# EAGLE design MakeItHackinDEFCON29Badge_5_withSOIC (EAGLE 9.6.2)
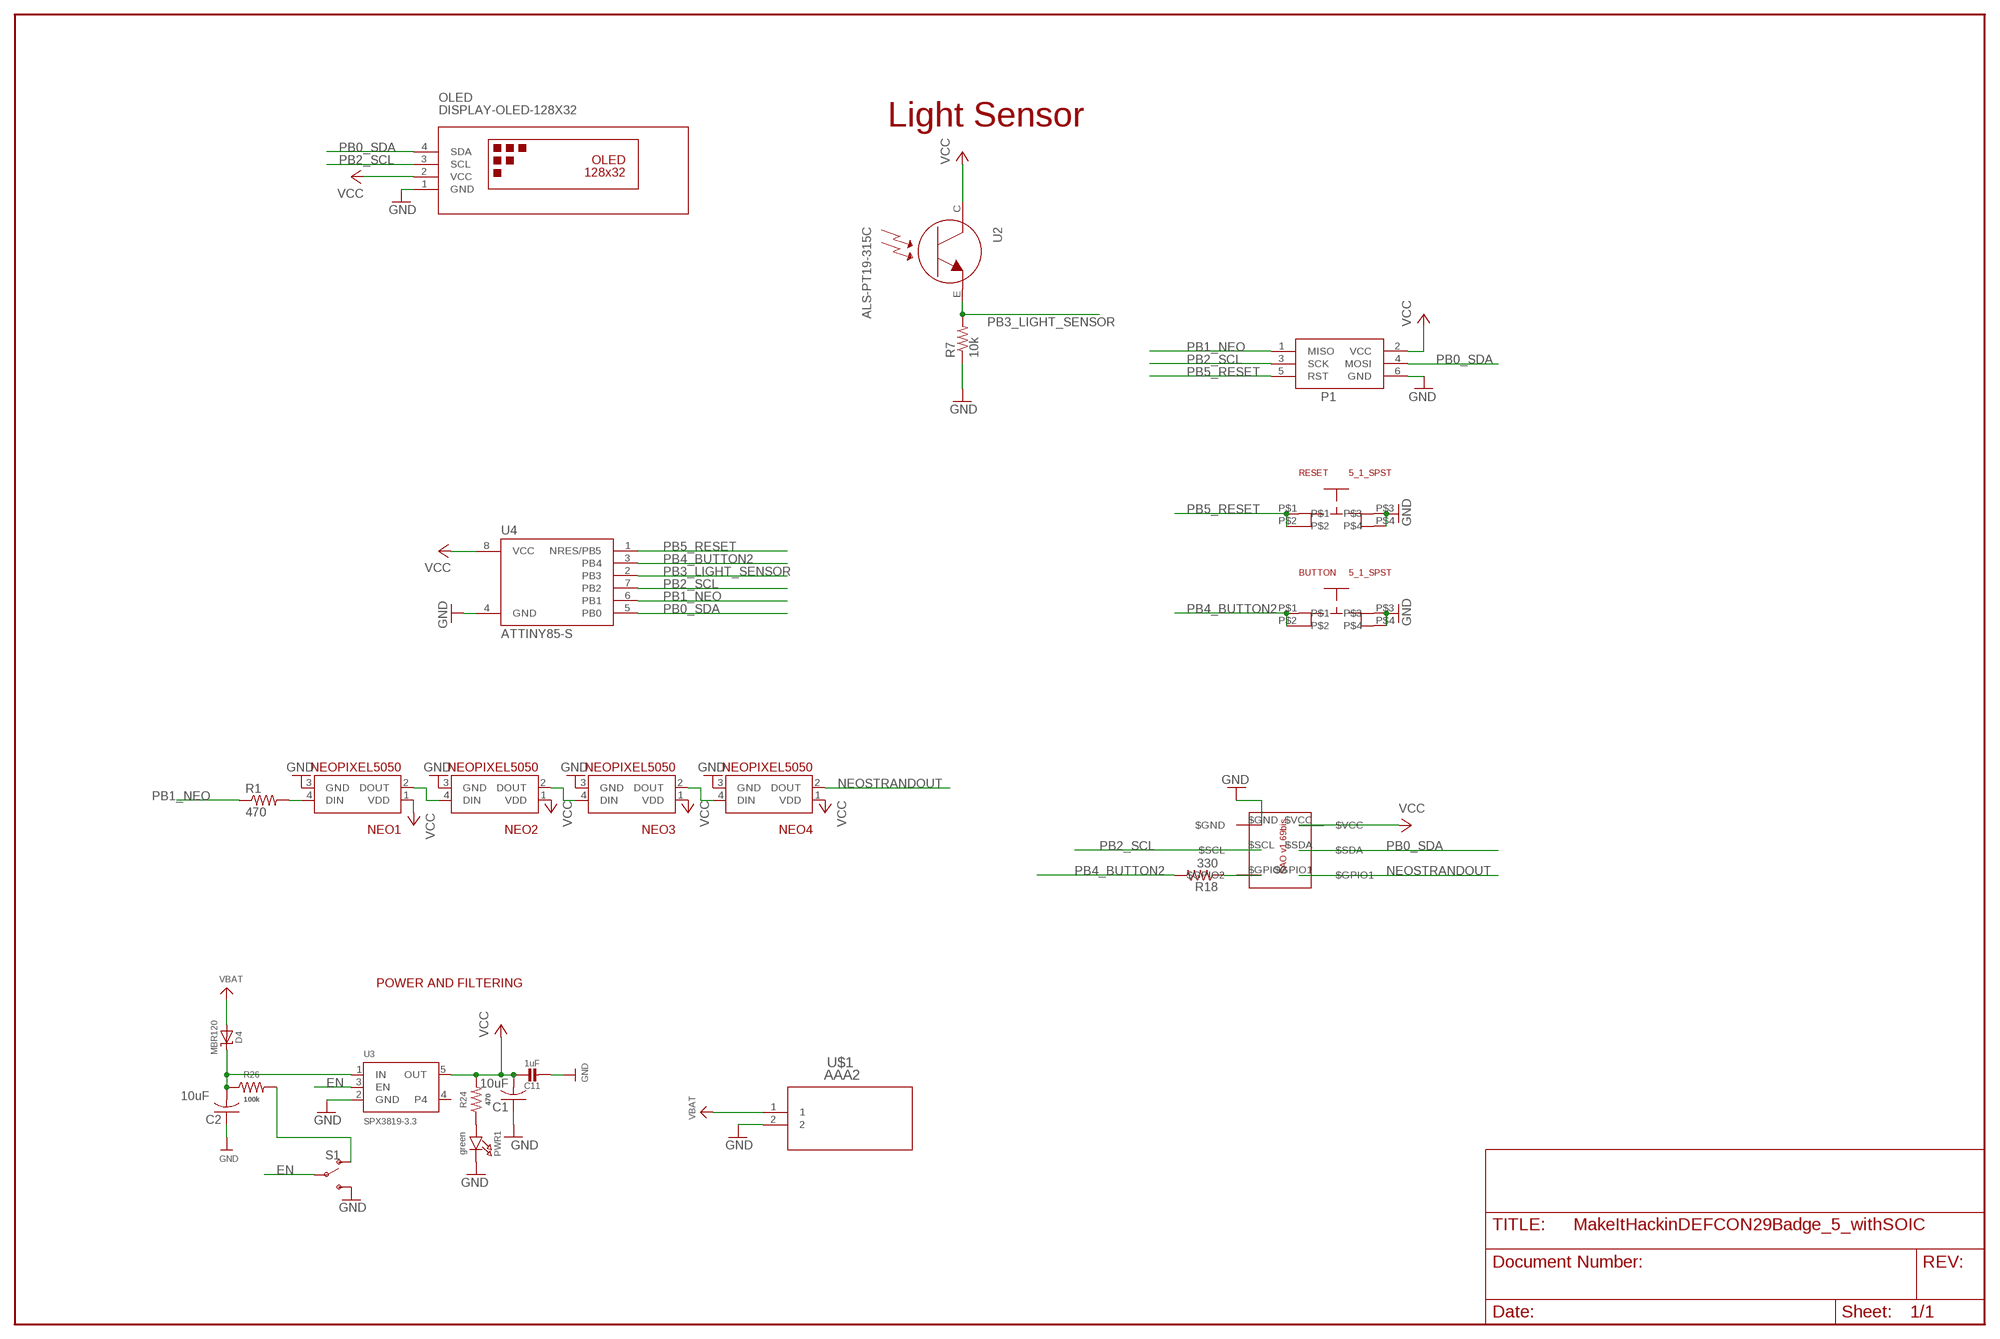
[diagram p0: schematic, sheet 1]

## Parts
BUTTON  5_1_SPST  [5_1_SPST]
C1  10uF  C-USC0805  [C0805]
C2  10uF  C-USC0805  [C0805]
C11  1uF  CAP_CERAMIC0805-NOOUTLINE  [0805-NO@1]
D4  MBR120  DIODE-SCHOTTKYSOD-123  [SOD-123]
NEO1  NEOPIXEL5050  [NEOPIXEL5050]
NEO2  NEOPIXEL5050  [NEOPIXEL5050]
NEO3  NEOPIXEL5050  [NEOPIXEL5050]
NEO4  NEOPIXEL5050  [NEOPIXEL5050]
OLED  DISPLAY-OLED-128X32  [DISPLAY-OLED-128X32]
P1  AVRISP-6  [AVRISP]
PWR1  green  LED0805_NOOUTLINE  [CHIPLED_0805_NOOUTLINE]
R1  470  R-US_R0805  [R0805]
R7  10k  R-US_R0805  [R0805]
R18  330  R-US_R0805  [R0805]
R24  470  R-US_R0805  [R0805]
R26  100k  R-US_R0805  [R0805]
RESET  5_1_SPST  [5_1_SPST]
S1  SWITCH-SPDT-SMD-AYZ0202  [SWITCH_DPDT_SMD_AYZ0202]
U2  ALS-PT19-315C  LIGHT_ALS-PT19-315C  [ALS-PT19-315C]
U3  SPX3819-3.3  VREG_SOT23-5  [SOT23-5]
U4  ATTINY85-S  [SOIC8_EIAJ_208MIL]
U$1  AAA2  [AAA2]
U$3  SAO-1.69  [2X3-SHROUDED-FEMALE]

## Nets
EN: S1.2(P) U3.3(EN)
GND [PWR]: BUTTON.P$3 BUTTON.P$4 C1.1 C2.1 C11.2 NEO1.3(GND) NEO2.3(GND) NEO3.3(GND) NEO4.3(GND) OLED.1(GND) P1.6(GND) PWR1.C R7.1 RESET.P$3 RESET.P$4 S1.3(S) U3.2(GND) U4.4(GND) U$1.2 U$3.$GND
N$1 [5V]: C2.2 D4.C R26.1 U3.1(IN)
N$7: R18.1 U$3.$GPIO2
N$9: PWR1.A R24.1
N$11: R26.2 S1.1(O)
N$12: NEO1.4(DIN) R1.2
N$18: NEO1.2(DOUT) NEO2.4(DIN)
N$20: NEO2.2(DOUT) NEO3.4(DIN)
N$21: NEO3.2(DOUT) NEO4.4(DIN)
NEOSTRANDOUT: NEO4.2(DOUT) U$3.$GPIO1
PB0_SDA: OLED.4(SDA) P1.4(MOSI) U4.5(PB0) U$3.$SDA
PB1_NEO: P1.1(MISO) R1.1 U4.6(PB1)
PB2_SCL: OLED.3(SCL) P1.3(SCK) U4.7(PB2) U$3.$SCL
PB3_LIGHT_SENSOR: R7.2 U2.E U4.2(PB3)
PB4_BUTTON2: BUTTON.P$1 BUTTON.P$2 R18.2 U4.3(PB4)
PB5_RESET: P1.5(RST) RESET.P$1 RESET.P$2 U4.1(NRES/PB5)
VBAT [PWR]: D4.A U$1.1
VCC [PWR]: C1.2 C11.1 NEO1.1(VDD) NEO2.1(VDD) NEO3.1(VDD) NEO4.1(VDD) OLED.2(VCC) P1.2(VCC) R24.2 U2.C U3.5(OUT) U4.8(VCC) U$3.$VCC
Unconnected: U3.4

## Notes on the sheet
- Light Sensor
- POWER AND FILTERING

## Library data of the parts
BUTTON RESET = TrophyParts:5_1_SPST
C1 C2 = rcl:C-US: CAPACITOR, American symbol; SPICEPREFIX: C
C11 = microbuilder:CAP_CERAMIC: Ceramic Capacitors For new designs, use the packages preceded by an '_' character since they are more reliable: The following footprints should be used on most boards: _0402 - Standard footprint for regular board layouts _0603 - Standard footprint for regular board layouts _0805 - Standard footprint for regular board layouts _1206 - Standard footprint for regular board layouts For extremely tight-pitch boards where space is at a premium, the following 'micro-pitch' footprints can be used (smaller pads, no silkscreen outline, etc.): _0402MP - Micro-pitch footprint for very dense/compact boards _0603MP - Micro-pitch footprint for very dense/compact boards _0805MP - Micro-pitch footprint for very dense/compact boards _1206MP - Micro-pitch footprint for very dense/compact boards
D4 = microbuilder:DIODE-SCHOTTKY
NEO1-NEO4 = TrophyParts:NEOPIXEL5050
OLED = Hatch2020:DISPLAY-OLED-128X32: 128x32 Dot Matrix OLED Module with I2C interface based on SSD1306 chip More details available here: http://www.tinyosshop.com/index.php?route=product/product&product_id=953 Schematic available here: http://www.tinyosshop.com/datasheet/OLED%2012832.pdf SSD1306 datasheet: https://cdn-shop.adafruit.com/datasheets/SSD1306.pdf Click here to find device on ebay.com <http://www.ebay.com/sch/oled+display+128x32+i2c>
P1 = adafruit:AVRISP: AVR ISP HEADER Standard 6 pin header for AVR programming
PWR1 = microbuilder:LED: LED 0603 - 0603 Surface Mount Package 2mA: Green LED - Low Power (3.9mcd, 2ma, 1.7Vf) - Digikey: 475-2709-2-ND Orange LED - Low Power (9.8mcd, 2ma, 1.8Vf) - Digikey: 475-1194-2-ND Red LED - Low Power (5mcd, 2ma, 1.8Vf) - Digikey: 475-1195-2-ND Yellow LED - Low Power (7mcd, 2ma, 1.8Vf) - Digikey: 475-1196-2-ND 5mA: Blue LED - Low Power (17mcd, 5ma, 2.9Vf) - Digikey: LNJ937W8CRACT-ND 0805 - 0805 Surface Mount Package 2mA: Red LED (8.8mcd, 2mA, 1.8Vf, Clear) - Low Power [Digikey: 475-2510-1-ND] Green LED (5mcd, 2mA, 1.8Vf, Clear) - Low Power [Digikey: 475-2730-1-ND] Yellow LED (11.3mcd, 2mA, 1.8Vf, Clear) - Low Power [Digikey: 475-2555-1-ND] 20mA: Red LED (104mcd, 20mA, Diffused) - LS R976 [Digikey: 475-1278-6-ND] Red LED (12mcd, 20mA, 2.0Vf, Clear) - APT2012EC [Digikey: 754-1128-1-ND] Green LED (15mcd, 20mA, 2.2Vf, Clear) - APT2012GC [Digikey: 754-1131-1-ND] Orange LED (160mcd, 20mA, 2.1Vf, Clear) - APT2012SECK [Digikey: 754-1130-1-ND] 1206 - 1206 Surface Mount Package Green LED (26mcd, 20mA, Diffused) - LG N971 [Digikey: 475-1407-6-ND] Red LED (15mcd, 20mA, Diffused) - LH N974 [Digikey: 475-1416-6-ND] Cree - Cree High-Power Surface Mount LEDs XPEBWT-L1-0000-00D50 - White 111lm 350mA 2.9Vf 6200K 110° XTEAWT-00-0000-00000LEE3 - White 114lm 350mA 2.85Vf 5000K 115° Everlight - Everlight 45-21 Series Surface Mount LEDs 45-21/QK2C-B2832AC2CB2/2T - Warm White 2000mcd 20mA 3.25Vf 3050K 120° 45-21/LK2C-B38452C4CB2/2T - Nuetral White 2000mcd 20mA 3.25Vf 4150K 120° 45-21/LK2C-B50634C6CB2/2T - Cold White 2200mcd 20mA 3.25Vf 5650K 120° PLCC2 Reverse Mount LS T77K-J1L2-1-0-2-R18-Z - Red 11.25mcd 2mA 1.8Vf 630nm 120° LO T77K-L1M2-24-Z - Orange 19.6mcd 2mA 1.8Vf 606nm 120° LY T77K-K2M1-26-Z - Yellow 15.7mcd 2mA 1.8Vf 587nm 120°
R1 R7 R18 R24 R26 = rcl:R-US_: RESISTOR, American symbol; SPICEPREFIX: R
S1 = SparkFun-Switches:SWITCH-SPDT: Single Pole, Double Throw (SPDT) Switch Single-pole, double-throw (SPDT) switch. Variant Overview SMD-AYZ0202 Surface Mount DPDT Switch <https://www.sparkfun.com/products/597> (COM-00597) Used on e.g. LilyPad Arduino USB - ATmega32U4 Board <https://www.sparkfun.com/products/12049> PTH-11.6X4.0MM SPDT Mini Power Switch <https://www.sparkfun.com/products/102> (COM-00102) Used on e.g. SparkFun Simon Says - Through-Hole Soldering Kit <https://www.sparkfun.com/products/10547> (KIT-10547) PTH-11.6X4.0MM-KIT KIT version of SPDT Mini Power Switch - Simplifies soldering by removing tStop of switch pins - only one side can be soldered. PTH-11.6X4.0MM-LOCK LOCK version of SPDT Mini Power Switch - Offset pins hold switch in place for easier soldering. SMD-RIGHT-ANGLE Surface Mount Right Angle Switch <https://www.sparkfun.com/products/10860> (COM-10860) Used on e.g. SparkFun ESP8266 Thing <https://www.sparkfun.com/products/13231>; PROD_ID: SWCH-08179; SF_ID: COM-00597
U2 = microbuilder:LIGHT_ALS-PT19-315C: ALS-PT19-315C - Analog Light Sensor VCC: 2.5-5.5V
U3 = microbuilder:VREG_SOT23-5: SOT23-5 Fixed Voltage Regulators Part Current Out V Out V In V Dropout θJA (°C/W) TJ (°C) Digikey Part No. ADP121 150mA 3.3V 3.4-5.5V 0.09V @ 150mA -- -- ADP121-AUJZ33R7CT-ND ADP121 150mA 3.0V 3.1-5.5V 0.09V @ 150mA -- -- ADP121-AUJZ30R7CT-ND ADP122 300mA 3.3V 3.4-5.5V 0.085V @ 300mA -- -- ADP122AUJZ-3.3-R7CT-ND ADP1712 300mA 3.3V 3.5-5.5V 0.17V @ 300mA -- -- ADP1712AUJZ-3.3-R7TR-ND AP7311 (Low Cost) 150mA 3.3V 3.5-6V 0.15V @ 150mA -- -- AP7311-33WG-7DICT-ND LD39015M18R 150mA 1.8V 1.9V-5.5V 0.08V @ 100mA -- -- 497-6977-1-ND LP2985A-33DBVR 150mA 3.3V 3.3-16V 0.28V @ 150mA 206 150 296-18479-1-ND MCP1824T-3302E/OT 300mA 3.3V 3.5V-6V 0.2V @ 300mA -- -- MCP1824T-3302E/OTCT-ND MIC5205-2.5YM5 TR 150mA 2.5V 2.7-16V 0.165V @ 150mA -- -- 576-1257-2-ND MIC5205-3.0YM5 TR 150mA 3.0V 3.2V-16V 0.165V @ 150mA -- -- 576-1258-2-ND MIC5205-3.3YM5 TR 150mA 3.3V 3.5V-16V 0.165V @ 150mA -- -- 576-1259-2-ND TPS780330220 150mA 3.3V+2.2V 3.6-5.5V 250mV Max -- -- 296-23332-1-ND TDA3663/N1,135 100mA 3.3V 3.5-45V 0.18V @ 50mA -- -- 568-5343-1-ND Max operating temp can be calculated using θJA, TJ (max junction temperature), and power in watts. Set the "Maximum Ambient Temperature" until it reaches TJ ("Max Junction Temperature"), which is the absolute limit for safe use of the regulator: Heat Sink Temperature Calculator <http://www.daycounter.com/Calculators/Heat-Sink-Temperature-Calculator.phtml> For example, With 12V source into a 3.3V LP2985 and a 30mA load, we are dissipating (12V-3.3V) * 0.03A = 0.261W. With a θJA of 206 °C/W, a TJ of 150°C, and 261mW we can safely use the chip without a heat sink up to 75°C (=147.1°C Junction Temperature).
U4 = attiny25_45_85:ATTINY85*: ATMEL ATtiny 85 Packages: P = PDIP 08 30mil S = SOIC 08 EIAJ 208mil Technologies Note: for complete ordering code (temp. range, finish, tape&reel etc.) see www.atmel.com • Supply Voltage: V = (1.8…5.5)V | [blank] = (2.7…5.5)V • Speed: 10 = 10 MHz | 20 = 20 MHz Author: Dipl.-Ing. FH Rainer Bayer HHN Hochschule Heilbronn (Heilbronn University), rainer.bayer@hs-heilbronn.de Ingenieurbüro ing-rb, mail@ing-rb.de
U$1 = keystoneAAAmount:AAA2
U$3 = Hatch2020:SAO-1.69

## Net classes
0 default: width 0.152 mm
1 PWR: width 0.254 mm
2 5V: width 0.254 mm
3 GND: width 0.254 mm

## Board
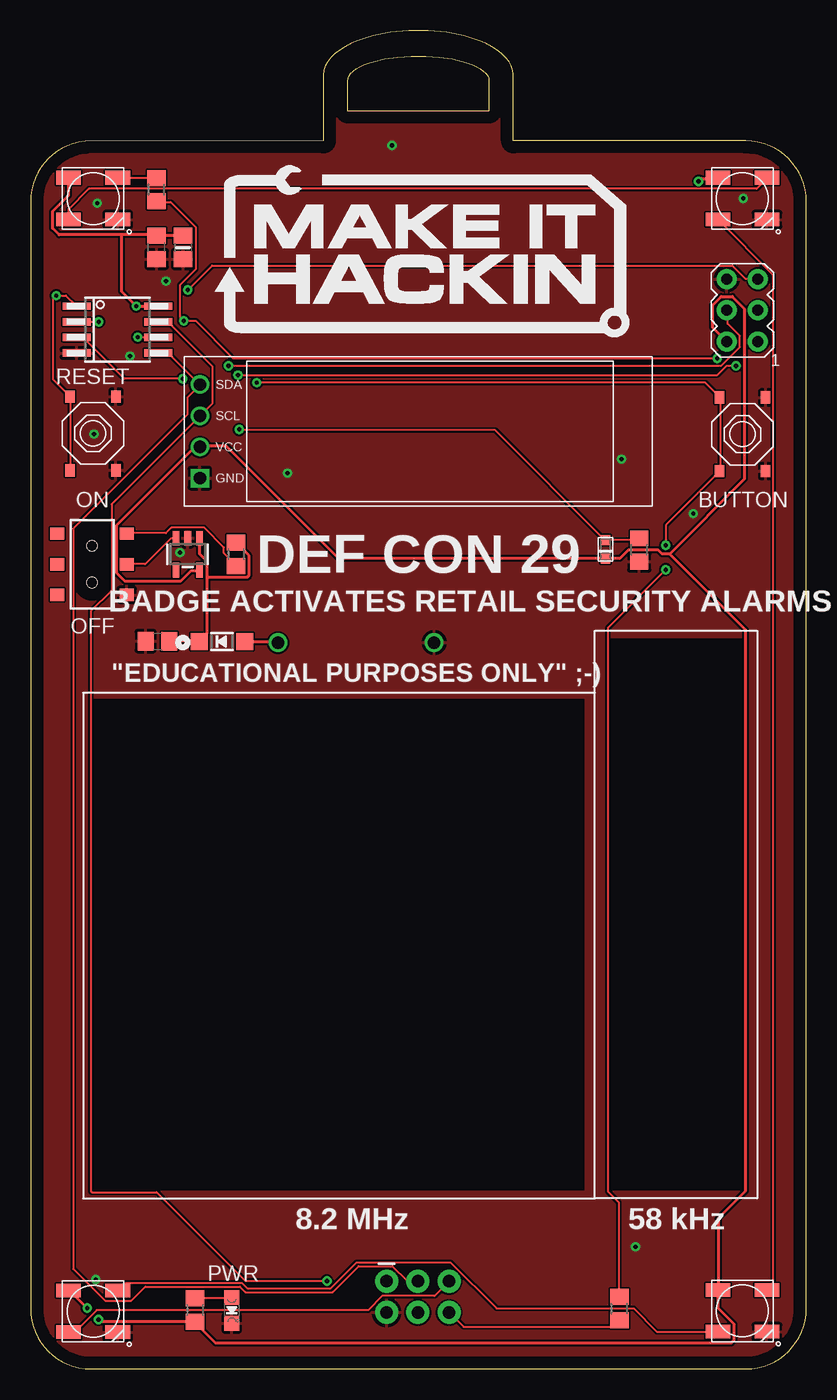
[diagram p1: board, top side]
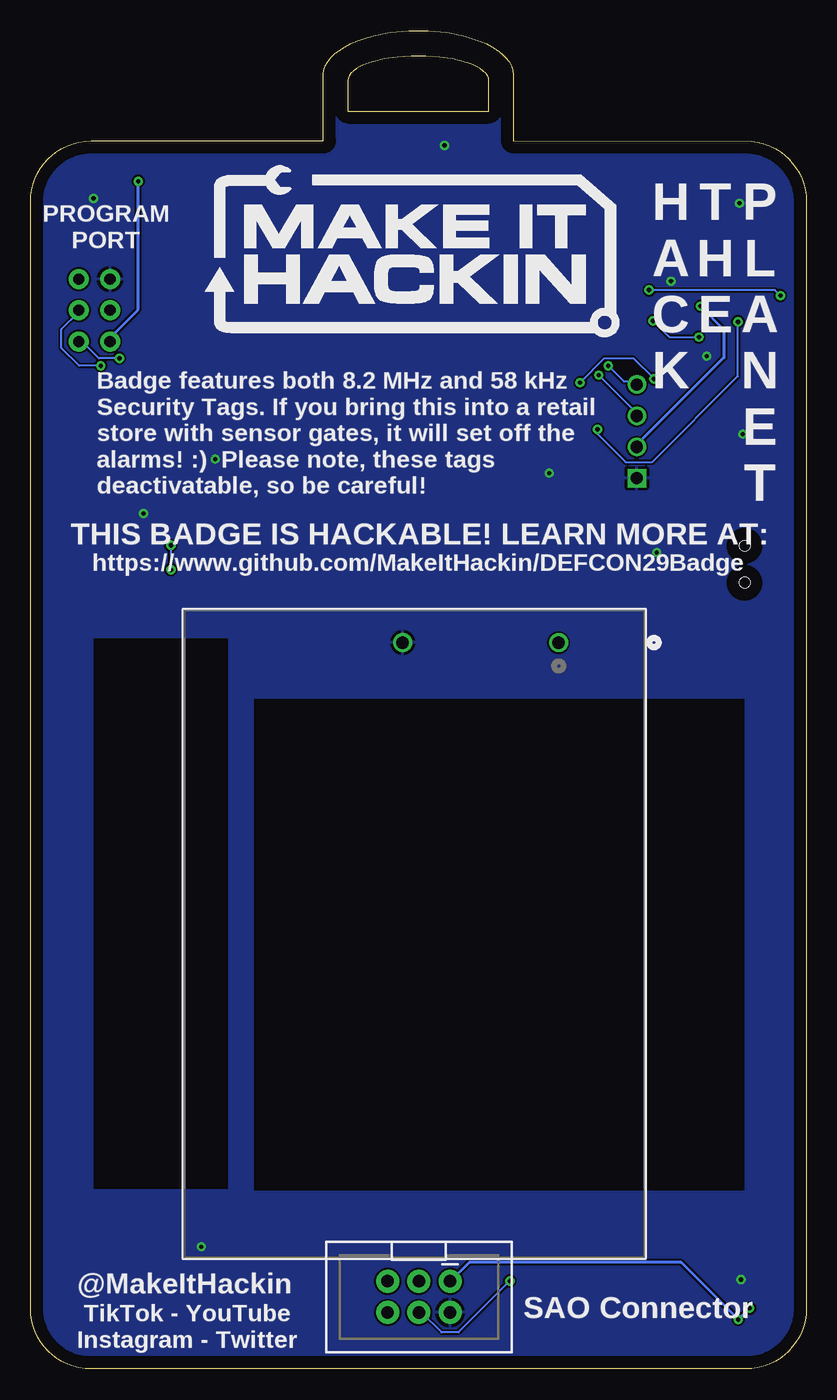
[diagram p2: board, bottom side, seen from below]

Size 63.11 x 108.95 mm. Coordinates in mm from the lower left corner, seen from the top.
Outline: 58.18,99.97 39.28,99.97 39.28,105.36 39.24,105.73 39.13,106.09 38.94,106.43 38.68,106.77 38.35,107.08 37.96,107.38 37.52,107.66 37.02,107.91 36.47,108.14 35.88,108.35 35.24,108.53 33.85,108.81 32.34,108.95 30.76,108.95 29.25,108.81 27.87,108.53 27.23,108.35 26.64,108.14 26.09,107.91 25.59,107.66 25.14,107.38 24.75,107.08 24.43,106.77 24.17,106.43 23.98,106.09 23.86,105.73 23.82,105.36 23.82,99.97 4.42,99.95 3.93,99.87 3.45,99.75 3,99.59 2.57,99.38 2.16,99.13 1.78,98.84 1.42,98.52 1.11,98.17 0.82,97.79 0.57,97.38 0.36,96.95 0.2,96.5 0.07,96.02 0,95.53 0,4.42 0.07,3.93 0.2,3.45 0.36,3 0.57,2.57 0.82,2.16 1.11,1.78 1.42,1.42 1.78,1.1 2.16,0.82 2.57,0.57 3,0.36 3.45,0.2 3.93,0.08 4.42,0 58.69,0 59.18,0.08 59.65,0.2 60.11,0.36 60.54,0.57 60.95,0.82 61.33,1.1 61.68,1.42 62,1.78 62.29,2.16 62.53,2.57 62.74,3 62.91,3.45 63.03,3.93 63.11,4.42 63.11,95.53 63.03,96.02 62.91,96.5 62.74,96.95 62.53,97.38 62.29,97.79 62,98.17 61.68,98.52 61.33,98.84 60.95,99.13 60.54,99.38 60.11,99.59 59.65,99.75 59.18,99.87 58.69,99.95 58.18,99.97
Outline: 37.3,102.41 25.81,102.41 25.81,104.87 25.84,105.08 25.92,105.28 26.07,105.47 26.26,105.66 26.5,105.84 26.79,106 27.12,106.16 27.49,106.31 27.9,106.44 28.81,106.66 29.84,106.81 30.97,106.89 32.14,106.89 33.26,106.81 34.29,106.66 35.21,106.44 35.62,106.31 35.99,106.16 36.32,106 36.6,105.84 36.85,105.66 37.04,105.47 37.18,105.28 37.27,105.08 37.3,104.87 37.3,102.41
Copper layers (1*16): Top 0.035mm / dielectric 1.5mm / Bottom 0.035mm
Design rules "default *": minimum track width 6mil, minimum drill 0.35mm, track to track 6mil, track to pad 6mil, pad to pad 6mil, via to via 6mil, smd to smd 6mil, copper to edge 40mil, drill to drill 6mil, minimum pad ring 10mil, minimum via ring 8mil, stop-mask expansion 4mil, vias tented up to drill 15mil, thermal gap 10mil
tRestrict: area 5,14.5 to 45,54.5; area 47.1,14.5 to 58,59.5
bRestrict: area 5,14.5 to 44.9,54.5; area 47.1,14.6 to 58,59.5

### Footprints (pad centres in the part's own frame; a part is rotated, then mirrored left to right if it is on the bottom)
5_1_SPST = smd 1 x 0.75: P$1 -3,1.875; P$2 3,1.875; P$3 -3,-1.875; P$4 3,-1.875
C0805 = smd 1.3 x 1.5: 1 -0.95,0; 2 0.95,0
0805-NO@1 = smd 1.3 x 1.5: 1 -0.95,0; 2 0.95,0
SOD-123 = smd 1.4 x 1.4: A 1.85,0; C -1.85,0
NEOPIXEL5050 = smd 2 x 1.1: 1 -2,1.7; 2 -2,-1.7; 3 2,-1.7; 4 2,1.7
DISPLAY-OLED-128X32 = drill 1 square: 1 -17.78,-3.81 | drill 1: 2 -17.78,-1.27; 3 -17.78,1.27; 4 -17.78,3.81
AVRISP = drill 0.9 pad 1.626: 1 -1.27,2.54; 2 1.27,2.54; 3 -1.27,0; 4 1.27,0; 5 -1.27,-2.54; 6 1.27,-2.54
CHIPLED_0805_NOOUTLINE = smd 1.2 x 1.2: A 0,-1.05; C 0,1.05
R0805 = smd 1.3 x 1.5: 1 -0.95,0; 2 0.95,0
SWITCH_DPDT_SMD_AYZ0202 = smd 1 x 1.15: 1 -2.5,2.825; 2 0,2.825; 3 2.5,2.825; 4 -2.5,-2.825; 5 0,-2.825; 6 2.5,-2.825 | hole 0.85: 1.5,0; -1.5,0
ALS-PT19-315C = smd 0.8 x 0.8: C -0.75,0; E 0.75,0
SOT23-5 = smd 0.55 x 1.2: 1 -0.95,-1.3; 2 0,-1.3; 3 0.95,-1.3; 4 0.95,1.3; 5 -0.95,1.3
SOIC8_EIAJ_208MIL = smd 0.6 x 2.286: 1 -1.905,-3.33; 2 -0.635,-3.33; 3 0.635,-3.33; 4 1.905,-3.33; 5 1.905,3.33; 6 0.635,3.33; 7 -0.635,3.33; 8 -1.905,3.33
AAA2 = drill 1.016 pad 1.524: 1 -11.43,-24.13; 2 1.27,-24.13
2X3-SHROUDED-FEMALE = drill 1.016 pad 1.88: $GND 1.27,2.54; $GPIO1 3.81,-2.54; $GPIO2 1.27,-2.54; $SCL 1.27,0; $SDA 3.81,0; $VCC 3.81,2.54

### Placement (x,y rotation side)
BUTTON  57.94,76.09 90 top
C1  10.24,91.3 90 top
C2  10.31,59.24 0 top
C11  12.4,91.3 270 top
D4  15.57,59.22 0 top
NEO1  5.08,95.28 0 top
NEO2  57.93,95.28 0 top
NEO3  57.93,4.72 0 top
NEO4  5.08,4.68 0 top
OLED  31.55,76.33 0 top
P1  57.92,86.19 180 top
PWR1  16.37,4.76 180 top
R1  10.22,96 90 top
R7  49.53,66.67 90 top
R18  47.91,4.91 90 top
R24  13.37,4.78 270 top
R26  16.72,66.33 270 top
RESET  5.07,76.16 90 top
S1  4.99,65.51 270 top
U2  46.78,66.72 90 top
U3  12.78,66.33 180 top
U4  7.06,84.62 270 top
U$1  31.56,35 180 bottom
U$3  31.51,3.32 90 top

### Tracks (layer width: path | path; a pad name or v marks a point on that pad's centre or on a via)
EN
  Top 0.152: S1.2 7.88,65.52 9.32,65.52 11.43,67.63 U3.3
GND  (via drill 0.35)
  other vias: 12.14,66.46 5.16,76.11 11,88.55 5.41,94.9 57.99,95.28 8.08,82.46 29.42,99.6 20.91,72.93 48.08,74.08 5.29,7.27 49.23,9.94 53.93,69.63
  pour Top: -0.18,109.13 63.32,109.13 63.32,-0.22 -0.18,-0.22
  pour Bottom: -0.56,109.38 63.58,109.38 63.58,-0.47 -0.56,-0.47
N$1
  Top 0.254: 14.35,64.45 14.35,59.88 13.74,59.27 D4.C 13.67,59.27 11.31,59.27 C2.2 | 14.35,64.45 14.35,65.74 13.74,66.35 13.74,67.57 U3.1 | 14.35,64.45 17.63,64.45 17.78,64.6 17.78,66.2 R26.1
N$7
  Top 0.152: R18.1 47.87,3.41 35.23,3.41 34.09,4.56 U$3.$GPIO2
N$9
  Top 0.152: PWR1.A 16.33,5.77 13.44,5.77 R24.1
N$11
  Top 0.152: S1.1 7.88,68.03 11,68.03 11.46,68.49 14.12,68.49 15.72,66.89 15.72,66.43 16.72,65.44 R26.2
N$12
  Top 0.152: R1.2 10.16,96.99 7.11,96.99 NEO1.4
N$18
  Top 0.152: NEO1.2 3.08,94.43 4.73,96.07 59.08,96.07 59.92,96.91 NEO2.4
N$20
  Top 0.152: NEO2.2 55.96,93.56 60.45,89.06 60.45,6.92 60,6.46 NEO3.4
N$21
  Top 0.152: NEO3.2 55.88,3.03 50.95,3.03 49.08,4.91 37.92,4.91 34.17,8.67 26.55,8.67 24.41,6.54 17.63,6.54 17.17,6.99 7.72,6.99 7.11,6.38 NEO4.4
NEOSTRANDOUT
  Top 0.152: NEO4.2 3.15,3.03 3.61,3.03 5.36,4.78 27.46,4.78 28.6,5.93 32.87,5.93 34.01,7.07 U$3.$GPIO1
PB0_SDA  (via drill 0.35)
  Top 0.152: v16.11,81.67 56.19,81.67 57.71,83.19 57.71,84.11 56.72,85.1 56.72,86.17 P1.4 | U$3.$SDA 31.5,7.15 30.66,7.15 29.44,8.37 26.7,8.37 24.56,6.23 17.48,6.23 17.02,6.69 9.32,6.69 8.18,5.55 6.05,5.55 3.46,8.14 3.46,68.41 12.75,77.71 12.75,79.08 13.74,80.07 OLED.4 11.2,82.71 U4.5
  Bottom 0.152: v16.11,81.67 14.81,80.37 14.51,80.37 14.28,80.15 13.82,80.15 OLED.4
PB1_NEO  (via drill 0.35)
  Top 0.152: R1.1 10.24,95.01 11.38,95.01 13.44,92.95 13.44,89.54 12.14,88.25 12.14,85.63 v12.45,85.33 13.41,85.33 16.46,82.28 v55.88,82.28 | v8.71,84.01 10.37,84.01 U4.6
  Bottom 0.152: v12.45,85.33 11.13,84.01 v8.71,84.01 | v55.88,82.28 57.56,82.28 58.85,83.58 59.16,83.58 P1.1
PB2_SCL  (via drill 0.35)
  Top 0.152: v57.41,81.67 56.64,81.67 55.88,80.91 v16.87,80.91 | v24.11,7.15 17.48,7.15 10.24,14.39 4.98,14.39 4.9,14.46 4.9,61.71 6.58,63.38 6.58,70.39 13.74,77.56 OLED.3 13.82,77.63 14.81,78.62 14.81,81.58 11.14,85.25 U4.7
  Bottom 0.152: v57.41,81.67 59.16,81.67 60.61,83.12 60.61,84.64 59.24,86.01 59.24,86.17 P1.3 | v16.87,80.91 13.82,77.86 13.82,77.63 OLED.3 | v24.11,7.15 28.3,2.96 29.67,2.96 31.27,4.56 31.5,4.56 U$3.$SCL
PB3_LIGHT_SENSOR  (via drill 0.35)
  Top 0.152: R7.2 49.48,67.57 49.41,67.5 46.81,67.5 U2.E 46.74,67.5 37.82,76.41 17.05,76.41 v16.97,76.49 | U4.2 3.68,85.2 5.49,85.2 v5.54,85.25
  Bottom 0.152: v16.97,76.49 16.97,76.11 14.68,73.82 12.52,73.82 5.54,80.81 v5.54,85.25
PB4_BUTTON2  (via drill 0.35)
  Top 0.152: v18.39,80.3 54.89,80.3 56.03,79.16 BUTTON.P$2 56.11,79.08 56.11,73.14 BUTTON.P$1 56.03,73.06 51.69,68.72 v51.69,67.04 | v51.69,65.06 46.97,60.33 46.97,14.46 47.88,13.55 47.88,6.36 R18.2 | U4.3 4.23,83.98 7.61,80.6 v12.37,80.6
  Bottom 0.152: v12.37,80.6 14.05,82.28 16.41,82.28 v18.39,80.3 | v51.69,67.04 v51.69,65.06
PB5_RESET  (via drill 0.35)
  Top 0.152: RESET.P$1 3.23,73.21 3.23,79.16 RESET.P$2 3.15,79.23 1.83,80.55 1.83,87.13 v2.09,87.39 2.87,87.39 U4.1 | v12.78,87.84 14.76,89.82 57.1,89.82 58.17,88.76 59.16,88.76 P1.5
  Bottom 0.152: v12.78,87.84 2.54,87.84 v2.09,87.39
VBAT
  Top 0.254: D4.A 17.48,59.19 20.07,59.19 U$1.1
VCC  (via drill 0.35)
  Top 0.254: v5.51,4.02 5.67,3.87 13.36,3.87 R24.2 13.44,3.72 15.04,2.12 57.03,2.12 57.25,2.35 57.25,3.64 55.96,4.94 55.96,6.38 NEO3.1 55.96,6.54 55.96,12.25 58.17,14.46 58.17,60.18 52,66.35 | v4.6,4.94 3.15,6.38 NEO4.1 | 52,66.35 51.39,66.35 51.08,66.66 48.64,66.66 47.96,65.97 46.81,65.97 U2.C 46.66,65.97 25.07,65.97 15.93,75.12 13.82,75.12 OLED.2 13.67,75.04 13.36,75.04 6.96,68.64 6.96,64.83 7.65,64.14 12.22,64.14 13.06,64.98 13.67,64.98 U3.5 | 52,66.35 58.09,72.45 58.09,86.32 57.1,87.31 56.19,87.31 55.5,86.62 55.5,84.79 P1.2 | v54.36,96.68 54.59,96.91 55.88,96.91 NEO2.1 | C11.1 12.37,92.26 10.31,92.26 C1.2 10.16,92.34 7.39,92.34 | 7.39,92.34 2.31,92.34 1.78,92.87 1.78,94.24 3.08,95.54 3.08,96.91 NEO1.1 | 7.39,92.34 7.39,87.72 v8.59,86.52 U4.8
  Bottom 0.254: v4.6,4.94 v5.51,4.02 10.16,8.67 27.43,8.67 U$3.$VCC | v54.36,96.68 54.36,86.24 56.64,83.96 P1.2 | v8.59,86.52 6.68,84.62 6.68,82.33 13.77,75.24 OLED.2

### Text on the board
tPlace: RESET | ON | BUTTON | DEF CON 29 | BADGE ACTIVATES RETAIL SECURITY ALARMS | OFF | "EDUCATIONAL PURPOSES ONLY" ;-) | 8.2 MHz | 58 kHz | PWR
bPlace: P / L / A / N / E / T | T / H / E | H / A / C / K | PROGRAM / PORT | Badge features both 8.2 MHz and 58 kHz / Security Tags. If you bring this into a retail / store with sensor gates, it will set off the / alarms! :) Please note, these tags / deactivatable, so be careful! | THIS BADGE IS HACKABLE! LEARN MORE AT: | https://www.github.com/MakeItHackin/DEFCON29Badge | @MakeItHackin | SAO Connector | TikTok - YouTube / Instagram - Twitter